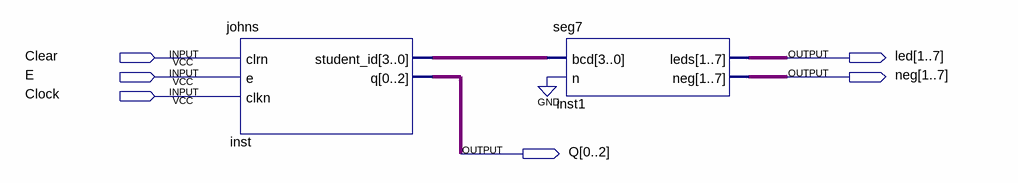
[diagram p0: schematic sheet]
// Quartus schematic john.bdf as structural Verilog: 2 symbols, 6 pins
module john (
  input  Clear,
  input  E,
  input  Clock,
  output [1:7] led,
  output [1:7] neg,
  output [0:2] Q
);

  wire [3:0] inst_student_id;

  johns inst (.clrn(Clear), .e(E), .clkn(Clock), .student_id(inst_student_id), .q(Q));
  seg7 inst1 (.bcd(inst_student_id), .n(1'b0), .leds(led), .neg(neg));
endmodule
